# EAGLE design Bigger ParolaV1 (EAGLE 6.5.0)
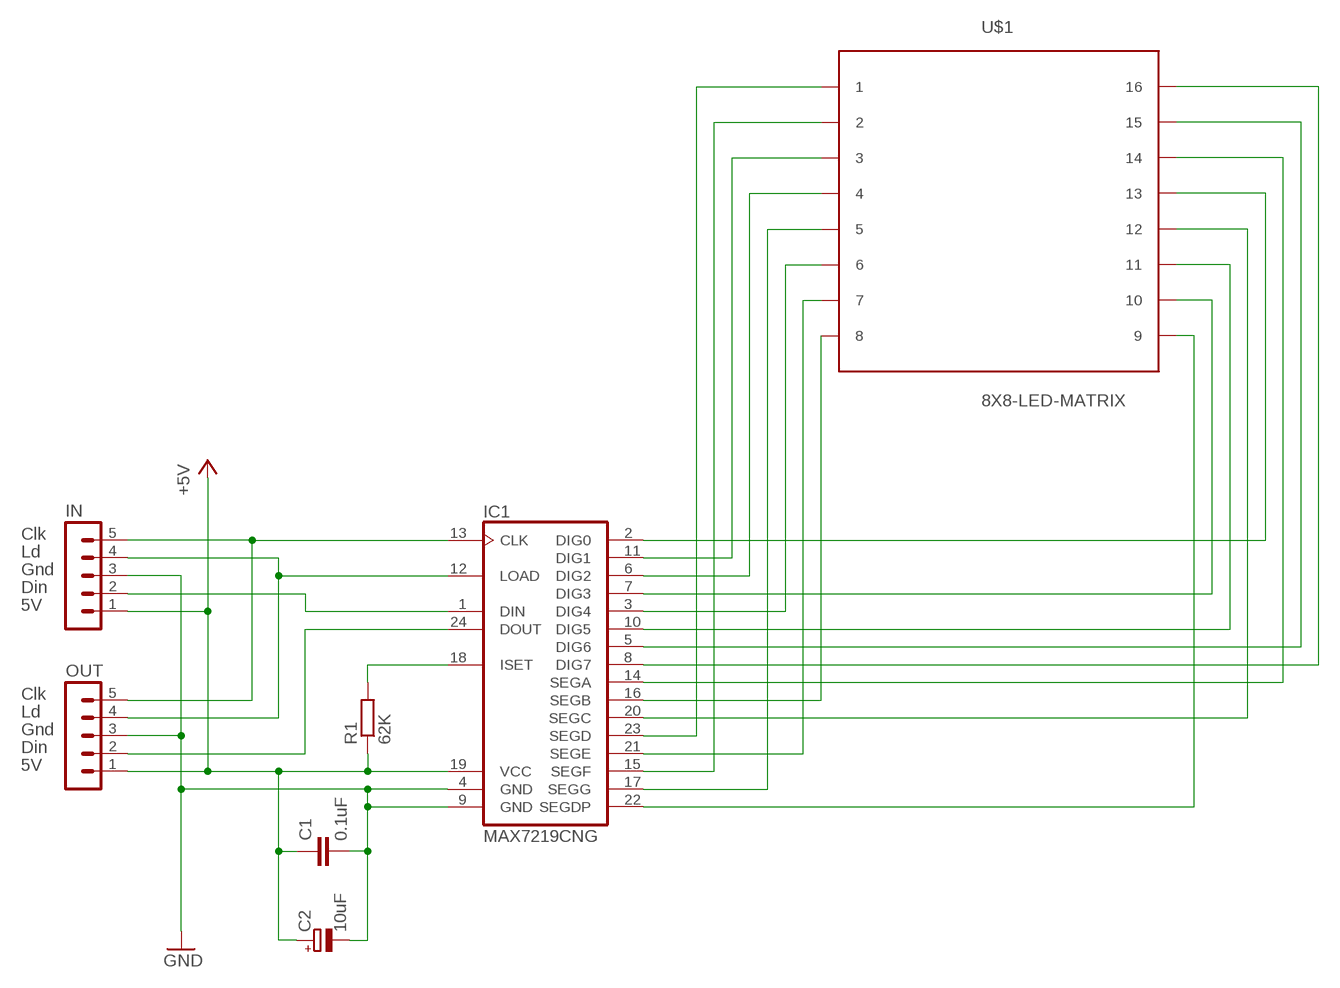
[diagram p0: schematic, sheet 1]

## Parts
C1  0.1uF  C-EU025-024X044  [C025-024X044]
C2  10uF  CPOL-EUE2-5  [E2-5]
IC1  MAX7219CNG  [DIL24-3]
IN  MAR05-1  [MAR05-1]
OUT  MAR05-1  [MAR05-1]
R1  62K  R-EU_0207/10  [0207/10]
U$1  8X8-LED-MATRIX  [8X8-LED-MATRIX]

## Nets
+5V [power]: C1.1 C2.+ IC1.19(VCC) IN.1 OUT.1 R1.1
GND [power]: C1.2 C2.- IC1.4(GND) IC1.9(GND) IN.3 OUT.3
N$1: IC1.18(ISET) R1.2
N$2: IC1.24(DOUT) OUT.2
N$3: IC1.12(LOAD) IN.4 OUT.4
N$4: IC1.13(CLK) IN.5 OUT.5
N$5: IC1.1(DIN) IN.2
N$6: IC1.2(DIG0) U$1.P$13
N$7: IC1.11(DIG1) U$1.P$3
N$8: IC1.6(DIG2) U$1.P$4
N$9: IC1.7(DIG3) U$1.P$10
N$10: IC1.3(DIG4) U$1.P$6
N$11: IC1.10(DIG5) U$1.P$11
N$12: IC1.5(DIG6) U$1.P$15
N$13: IC1.8(DIG7) U$1.P$16
N$14: IC1.14(SEGA) U$1.P$14
N$15: IC1.16(SEGB) U$1.P$8
N$16: IC1.20(SEGC) U$1.P$12
N$17: IC1.23(SEGD) U$1.P$1
N$18: IC1.21(SEGE) U$1.P$7
N$19: IC1.15(SEGF) U$1.P$2
N$20: IC1.17(SEGG) U$1.P$5
N$21: IC1.22(SEGDP) U$1.P$9

## Notes on the sheet
- Clk
- Ld
- Gnd
- Din
- 5V
- Clk
- Ld
- Gnd
- Din
- 5V

## Library data of the parts
C1 = rcl:C-EU: CAPACITOR, European symbol
C2 = rcl:CPOL-EU: POLARIZED CAPACITOR, European symbol
IC1 = maxim:MAX7219CNG: LED DISPLAY DRIVER; MF: MAXIM; MPN: MAX7219CNG; OC_FARNELL: 1523914; OC_NEWARK: 34C4018
IN OUT = con-lstb:MAR05-1: PIN HEADER; OC_FARNELL: unknown; OC_NEWARK: unknown
R1 = resistor:R-EU_: RESISTOR, European symbol
U$1 = 8 X 8 LED Matrix:8X8-LED-MATRIX

## Net classes
0 default: width 0.254 mm, drill 0.305 mm, clearance 0.254 mm
1 power: width 0.61 mm, drill 0.66 mm, clearance 0.254 mm

## Board
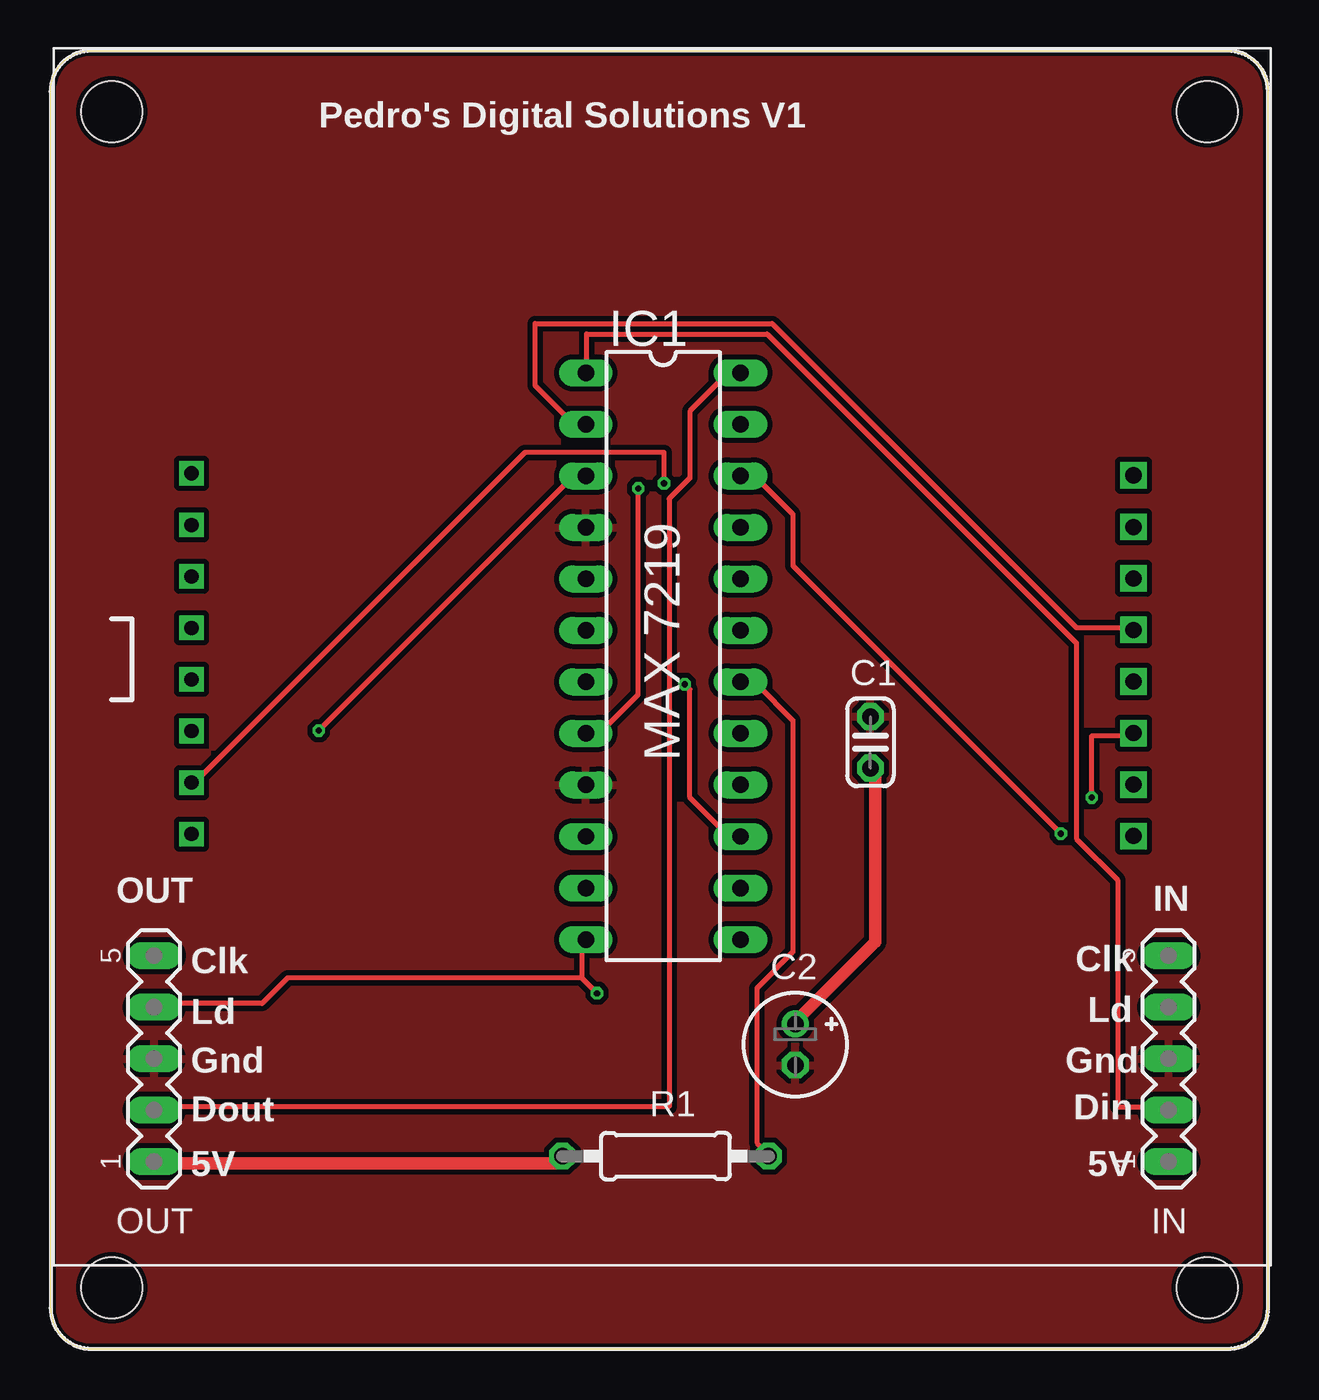
[diagram p1: board, top side]
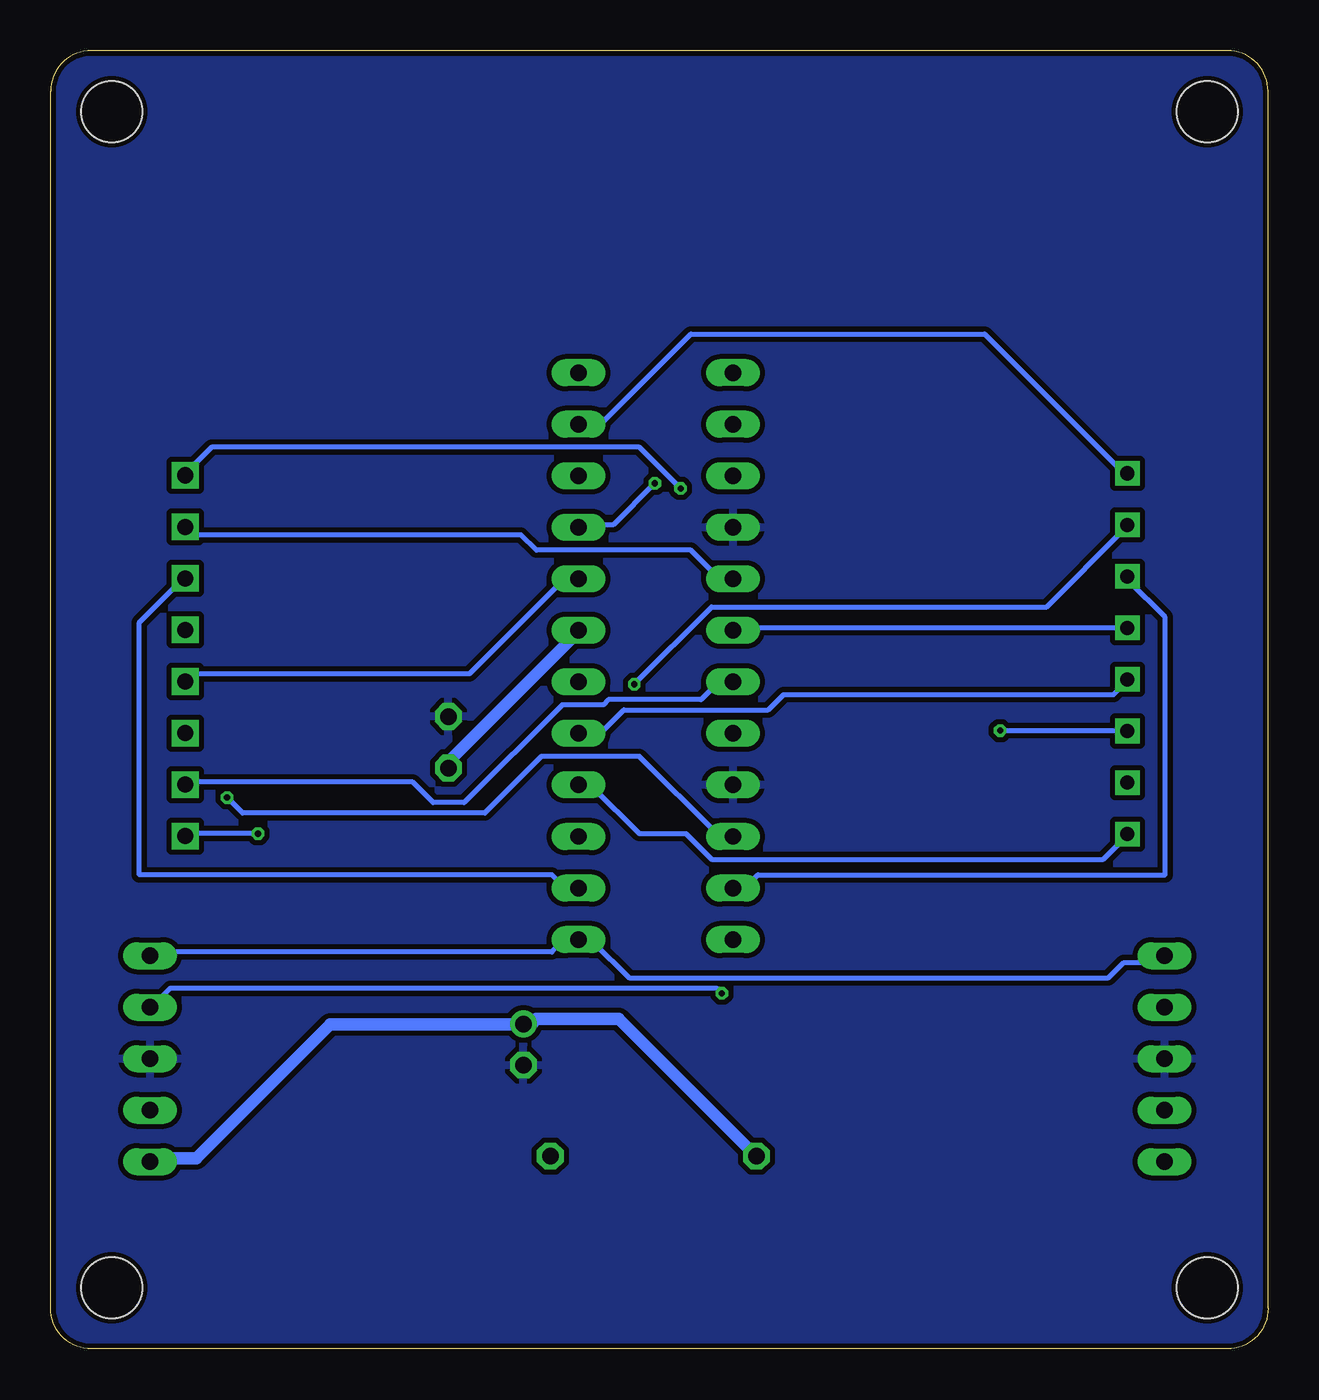
[diagram p2: board, bottom side, seen from below]

Size 60 x 64 mm. Coordinates in mm from the lower left corner, seen from the top.
Outline: 0,2 0,62 arc-90 2,64 58,64 arc-90 60,62 60,2 arc-90 58,0 2,0 arc-90 0,2
Copper layers (1*16): Top 0.035mm / dielectric 1.5mm / Bottom 0.035mm
Design rules "Fusion_eagle_rule_v1.1": minimum track width 6mil, minimum drill 12mil, track to track 6mil, track to pad 6mil, pad to pad 6mil, via to via 6mil, smd to smd 0mil, copper to edge 10mil, drill to drill 10mil, minimum pad ring 10mil, minimum via ring 6mil, stop-mask expansion 2mil, vias tented up to drill 100mil, thermal gap 10mil
Holes 3 mm at 3,61 57,61 3,3 57,3

### Footprints (pad centres in the part's own frame; a part is rotated, then mirrored left to right if it is on the bottom)
C025-024X044 = drill 0.813 octagon: 1 -1.27,0; 2 1.27,0
E2-5 = drill 0.813 pad 1.27: + -1.016,0 | drill 0.813 pad 1.27 octagon: - 1.016,0
DIL24-3 = drill 0.813 long: 1 -13.97,-3.81; 2 -11.43,-3.81; 3 -8.89,-3.81; 4 -6.35,-3.81; 5 -3.81,-3.81; 6 -1.27,-3.81; 7 1.27,-3.81; 8 3.81,-3.81; 9 6.35,-3.81; 10 8.89,-3.81; 11 11.43,-3.81; 12 13.97,-3.81; 13 13.97,3.81; 14 11.43,3.81; 15 8.89,3.81; 16 6.35,3.81; 17 3.81,3.81; 18 1.27,3.81; 19 -1.27,3.81; 20 -3.81,3.81; 21 -6.35,3.81; 22 -8.89,3.81; 23 -11.43,3.81; 24 -13.97,3.81
MAR05-1 = drill 0.813 long: 1 -5.08,0; 2 -2.54,0; 3 0,0; 4 2.54,0; 5 5.08,0
0207/10 = drill 0.813 octagon: 1 -5.08,0; 2 5.08,0
8X8-LED-MATRIX = drill 0.7 square: P$1 -23.2,9.04; P$2 -23.2,6.5; P$3 -23.2,3.96; P$4 -23.2,1.42; P$5 -23.2,-1.12; P$6 -23.2,-3.66; P$7 -23.2,-6.2; P$8 -23.2,-8.74 | drill 0.8 square: P$9 23.23,-8.84; P$10 23.23,-6.3; P$11 23.23,-3.76; P$12 23.23,-1.22; P$13 23.23,1.32; P$14 23.23,3.86; P$15 23.23,6.4; P$16 23.23,8.94

### Placement (x,y rotation side)
C1  40.4,29.9 90 top
C2  36.7,15 270 top
IC1  30.18,34.15 270 top
IN  55.1,14.3 90 top
OUT  5.1,14.3 90 top
R1  30.3,9.5 0 top
U$1  30.14,34.12 0 top

### Tracks (layer width: path | path; a pad name or v marks a point on that pad's centre or on a via)
+5V
  Top 0.61: OUT.1 5.33,9.14 25.15,9.14 25.15,9.4 R1.1 | C2.+ 36.83,16.26 40.64,20.07 40.64,28.45 C1.1
  Bottom 0.61: IN.1 54.86,9.4 52.83,9.4 46.23,16 36.83,16 C2.+ 36.58,16 36.32,16 36.07,16.26 32,16.26 25.4,9.65 R1.1 | IC1.19 34.04,35.31 40.64,28.7 C1.1
GND
  pour Bottom: -1,65 61,65 61,-1 -1,-1
  pour Top: -2,66 62,66 62,-2 -2,-2
N$1
  Top 0.254: R1.2 35.31,9.65 34.8,10.16 34.8,17.78 36.58,19.56 36.58,30.99 34.8,32.77 34.04,32.77 IC1.18
N$2
  Top 0.254: OUT.2 5.33,11.94 30.48,11.94 30.48,41.91 31.5,42.93 31.5,46.23 33.27,48.01 33.78,48.01 IC1.24
N$3  (via drill 0.3)
  Top 0.254: 26.16,18.29 11.68,18.29 10.41,17.02 5.33,17.02 OUT.4 | 26.16,18.29 26.16,20.07 IC1.12 | 26.16,18.29 v26.92,17.53
  Bottom 0.254: v26.92,17.53 27.18,17.78 54.1,17.78 54.86,17.02 IN.4
N$4
  Bottom 0.254: OUT.5 5.33,19.3 5.59,19.05 7.11,19.05 7.87,18.29 31.5,18.29 33.27,20.07 33.78,20.07 IC1.13 34.04,20.07 34.8,20.07 35.31,19.56 54.86,19.56 IN.5
N$5
  Top 0.254: IN.2 54.86,11.94 52.58,11.94 52.58,23.11 50.55,25.15 50.55,34.8 35.31,50.04 26.42,50.04 26.42,48.26 IC1.1
N$6
  Top 0.254: U$1.P$13 53.34,35.56 50.55,35.56 35.56,50.55 23.88,50.55 23.88,47.5 25.65,45.72 26.16,45.72 IC1.2
N$7
  Bottom 0.254: U$1.P$3 6.86,37.85 5.08,36.07 5.08,23.37 25.15,23.37 25.65,22.86 26.16,22.86 IC1.11
N$8
  Bottom 0.254: U$1.P$4 7.11,35.56 26.16,35.56 IC1.6
N$9
  Bottom 0.254: U$1.P$10 53.34,27.94 42.16,27.94 41.15,26.92 39.62,26.92 34.8,31.75 32.77,31.75 32.51,32 27.94,32 27.18,32.77 26.42,32.77 IC1.7
N$10  (via drill 0.3)
  Top 0.254: v13.21,30.48 25.65,42.93 26.16,42.93 IC1.3
  Bottom 0.254: v13.21,30.48 7.11,30.48 U$1.P$6
N$11  (via drill 0.3)
  Top 0.254: v51.31,27.18 51.31,30.23 53.34,30.23 U$1.P$11
  Bottom 0.254: v51.31,27.18 50.55,26.42 38.61,26.42 35.81,29.21 30.99,29.21 27.18,25.4 26.42,25.4 IC1.10
N$12
  Bottom 0.254: U$1.P$15 53.34,40.39 53.09,40.13 36.83,40.13 36.07,39.37 28.45,39.37 27.18,38.1 26.42,38.1 IC1.5
N$13  (via drill 0.3)
  Top 0.254: v28.96,42.42 28.96,32.26 27.18,30.48 26.42,30.48 IC1.8
  Bottom 0.254: v28.96,42.42 30.99,44.45 52.07,44.45 53.34,43.18 U$1.P$16
N$14
  Bottom 0.254: U$1.P$14 53.59,37.85 55.63,35.81 55.63,23.37 35.31,23.37 34.8,22.86 34.04,22.86 IC1.14
N$15
  Bottom 0.254: U$1.P$8 7.11,25.15 8.13,24.13 27.43,24.13 28.7,25.4 30.99,25.4 33.27,27.69 33.78,27.69 IC1.16
N$16
  Bottom 0.254: U$1.P$12 53.34,33.02 53.09,33.27 39.37,33.27 34.8,37.85 34.04,37.85 IC1.20
N$17
  Bottom 0.254: U$1.P$1 7.11,43.18 13.97,50.04 28.45,50.04 32.77,45.72 33.78,45.72 IC1.23
N$18  (via drill 0.3)
  Top 0.254: v30.23,42.67 30.23,44.2 23.37,44.2 7.11,27.94 U$1.P$7
  Bottom 0.254: v30.23,42.67 32.26,40.64 33.78,40.64 IC1.21
N$19  (via drill 0.3)
  Top 0.254: v31.24,32.77 31.5,32.51 31.5,27.18 33.27,25.4 33.78,25.4 IC1.15
  Bottom 0.254: v31.24,32.77 27.43,36.58 10.92,36.58 7.11,40.39 U$1.P$2
N$20
  Bottom 0.254: U$1.P$5 7.11,32.77 7.62,32.26 23.88,32.26 24.64,31.5 31.75,31.5 32.77,30.48 33.78,30.48 IC1.17
N$21  (via drill 0.3)
  Top 0.254: v49.78,25.4 36.58,38.61 36.58,41.15 34.8,42.93 34.04,42.93 IC1.22
  Bottom 0.254: v49.78,25.4 53.34,25.4 U$1.P$9

### Text on the board
tPlace: Pedro's Digital Solutions V1 | OUT | IN | Clk | Clk | Ld | Ld | Gnd | Gnd | Dout | Din | 5V | 5V
tNames: MAX 7219